# EAGLE design SPDT_eval (EAGLE 8.5.1)
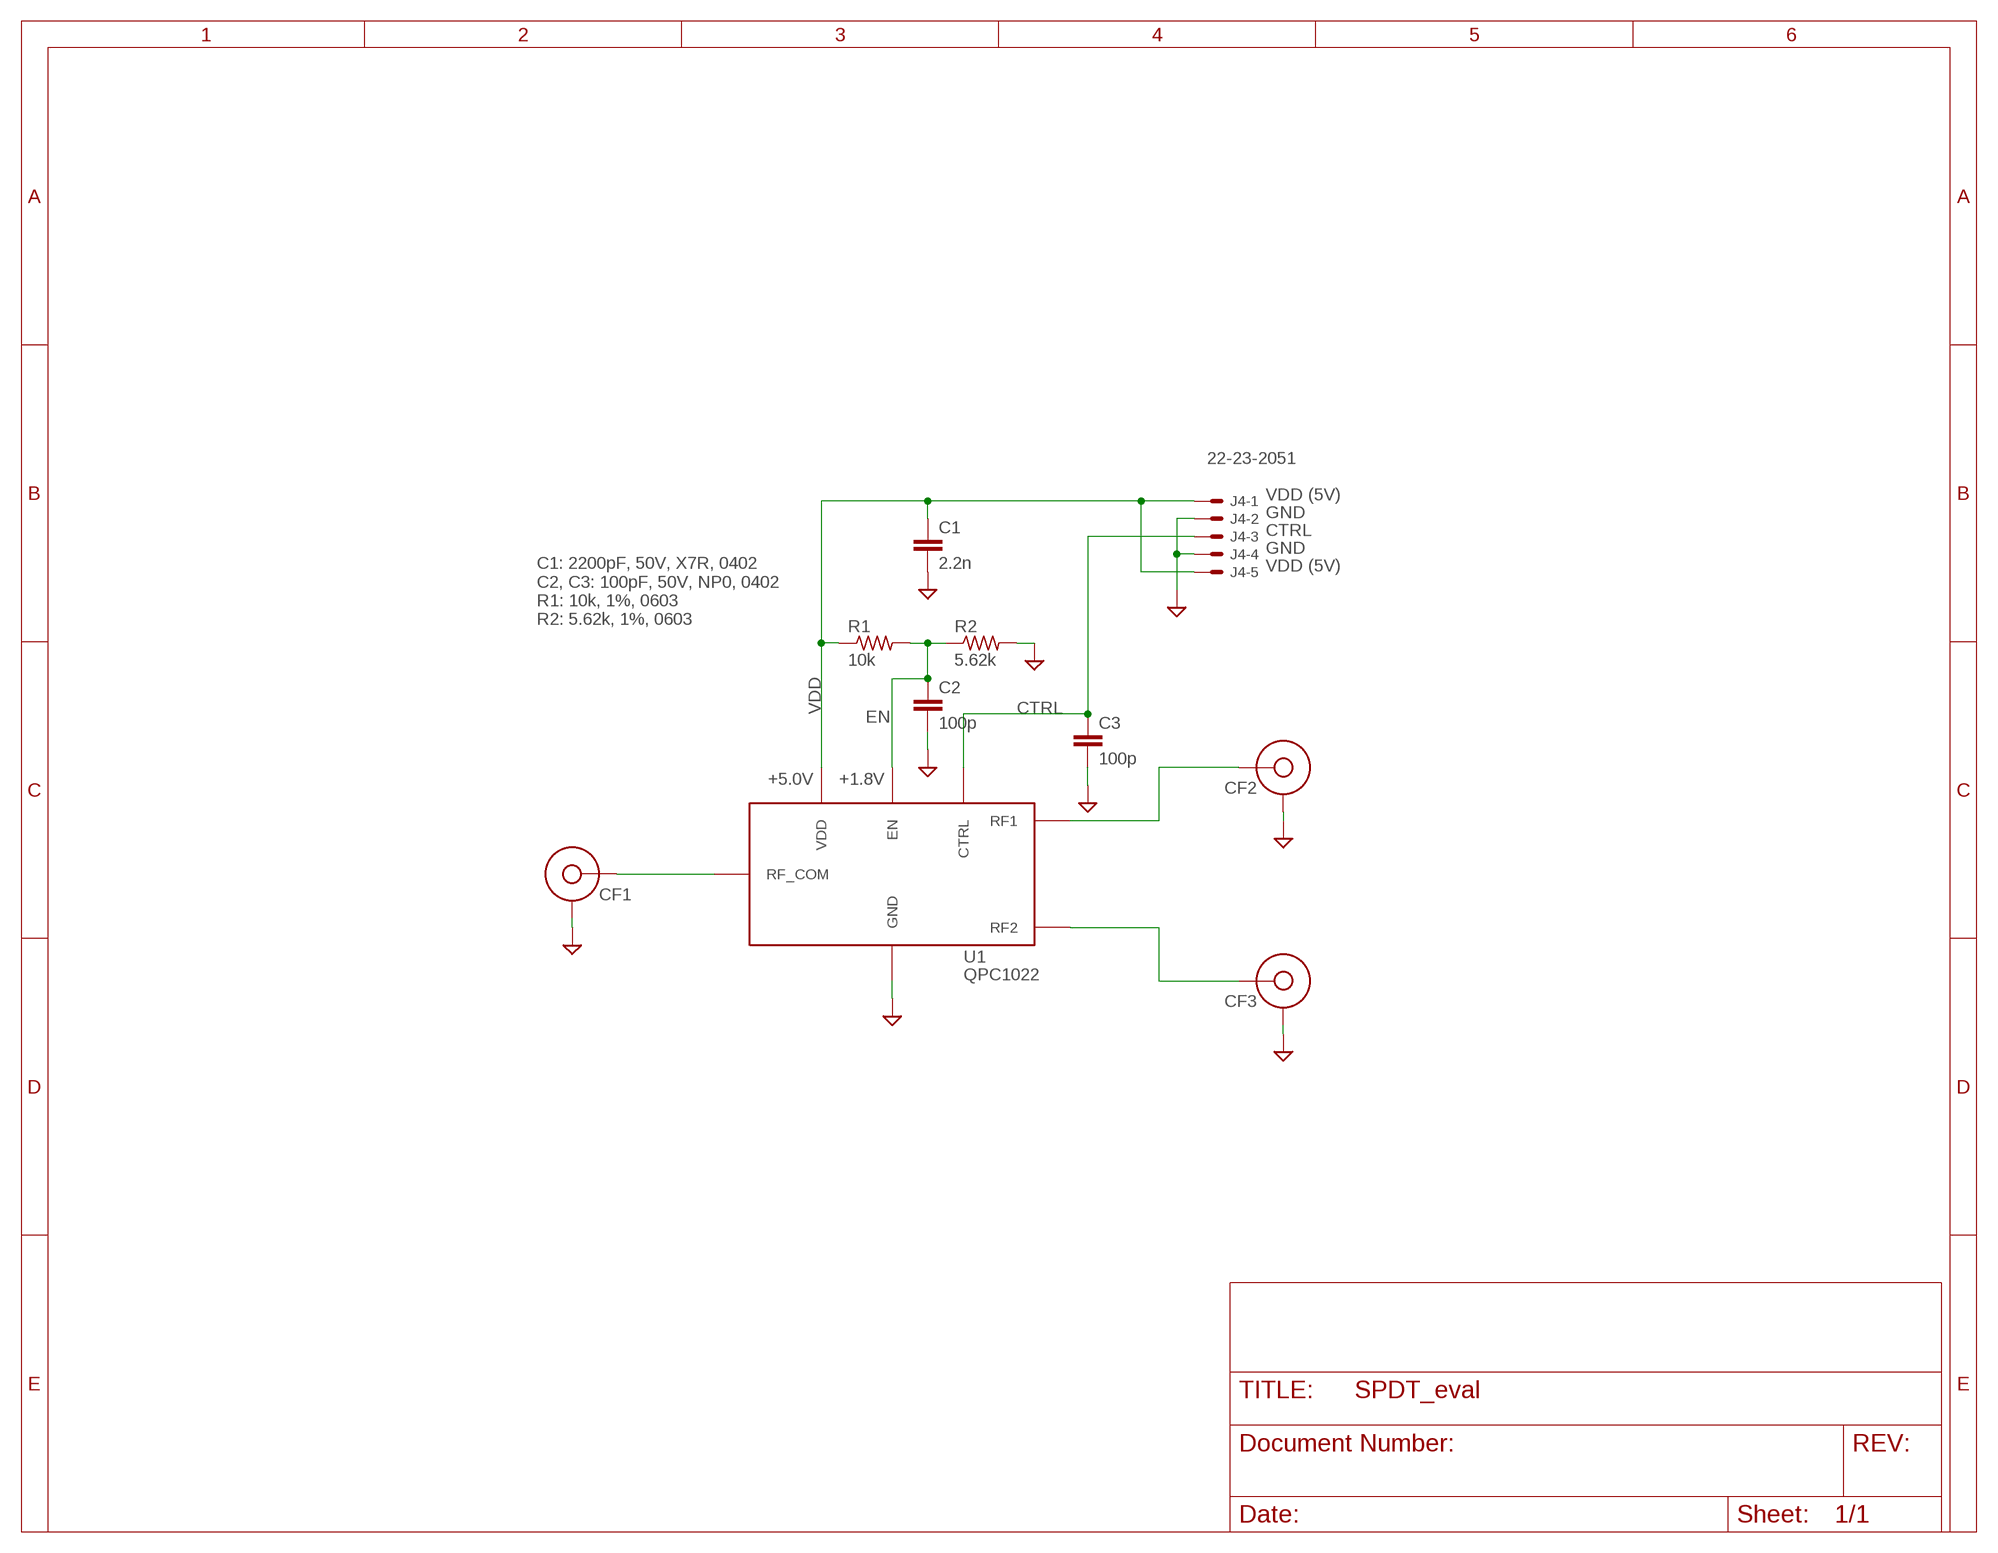
[diagram p0: schematic, sheet 1]

## Parts
C1  2.2n  C-EU0402-B-NOSILK  [.0402-B-NOSILK]
C2  100p  C-EU0402-B-NOSILK  [.0402-B-NOSILK]
C3  100p  C-EU0402-B-NOSILK  [.0402-B-NOSILK]
CF1  SMA-CINCH-END-FIRE  [SMAJ716-ND]
CF2  SMA-CINCH-END-FIRE  [SMAJ716-ND]
CF3  SMA-CINCH-END-FIRE  [SMAJ716-ND]
J4  22-23-2051  [22-23-2051]
R1  10k  R-US_0603-B-NOSILK  [.0603-B-NOSILK]
R2  5.62k  R-US_0603-B-NOSILK  [.0603-B-NOSILK]
U1  QPC1022  [QPC1022]

## Nets
COM [RF]: CF1.P$3(CENTERCONDUCTOR) U1.ANT(RF_COM)
CTRL: C3.1 J4.3 U1.CTRL
EN: C2.1 R1.2 R2.1 U1.EN
GND: C1.2 C2.2 C3.2 CF1.GND1(GND) CF1.GND2(GND) CF1.GND3(GND) CF1.GND4(GND) CF2.GND1(GND) CF2.GND2(GND) CF2.GND3(GND) CF2.GND4(GND) CF3.GND1(GND) CF3.GND2(GND) CF3.GND3(GND) CF3.GND4(GND) J4.2 J4.4 R2.2 U1.GND@1(GND) U1.GND@2(GND) U1.GND@3(GND)
RF1 [RF]: CF2.P$3(CENTERCONDUCTOR) U1.RF1
RF2 [RF]: CF3.P$3(CENTERCONDUCTOR) U1.RF2
VDD: C1.1 J4.1 J4.5 R1.1 U1.VDD

## Notes on the sheet
- VDD (5V)
- GND
- CTRL
- GND
- VDD (5V)
- C1: 2200pF, 50V, X7R, 0402
  C2, C3: 100pF, 50V, NP0, 0402
  R1: 10k, 1%, 0603
  R2: 5.62k, 1%, 0603
- +5.0V | +1.8V

## Library data of the parts
C1-C3 = rcl_custom:C-EU: CAPACITOR, European symbol
CF1-CF3 = psas_c3_team05:SMA-CINCH-END-FIRE
J4 = con-molex:22-23-2051: .100" (2.54mm) Center Header - 5 Pin; MF: MOLEX; MPN: 22-23-2051; OC_FARNELL: 1462952; OC_NEWARK: 38C9178
R1 R2 = rcl_custom:R-US_: RESISTOR, American symbol
U1 = QPC1022:QPC1022

## Net classes
1 RF: clearance 1.016 mm

## Board
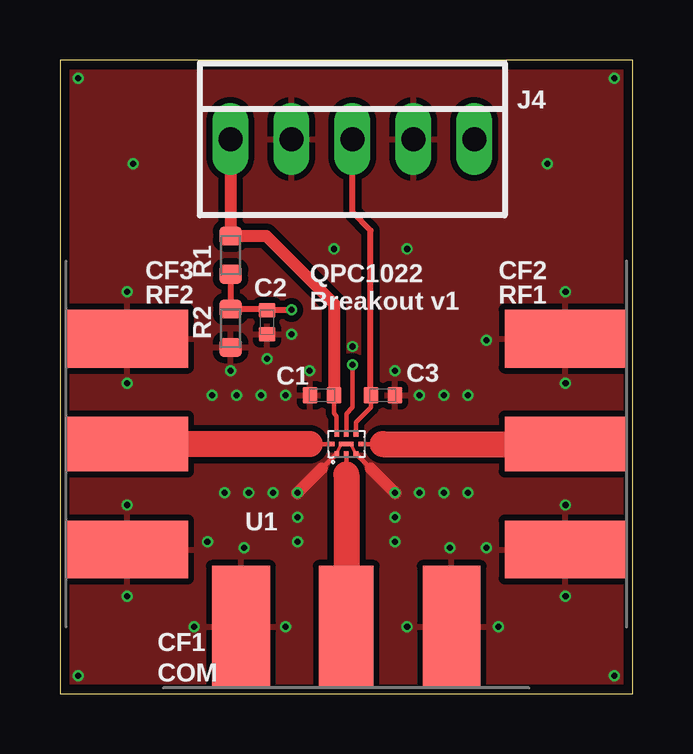
[diagram p1: board, top side]
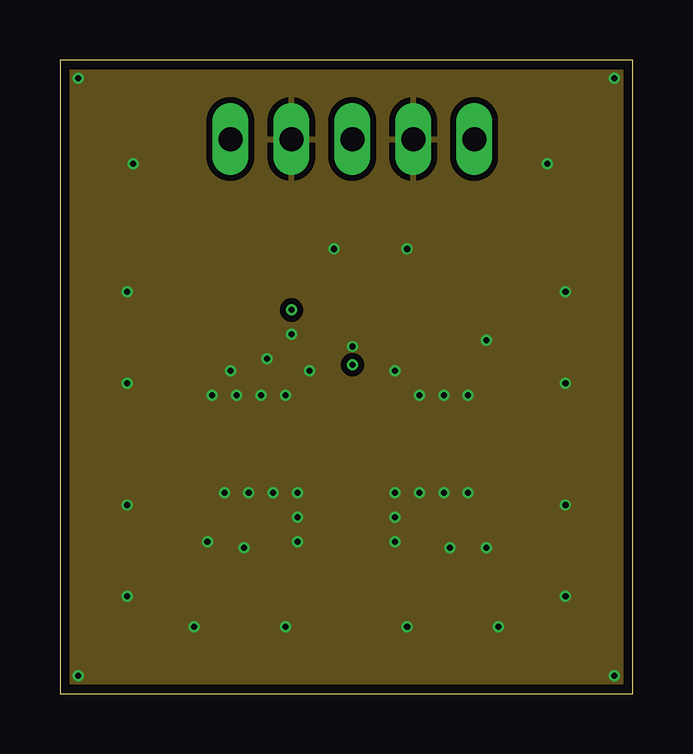
[diagram p2: board, inner layer Route2]
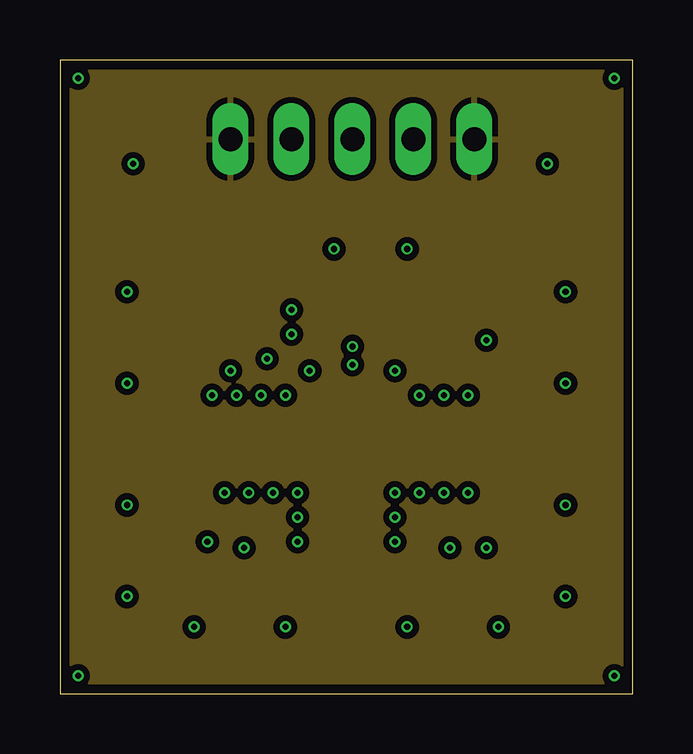
[diagram p3: board, inner layer Route15]
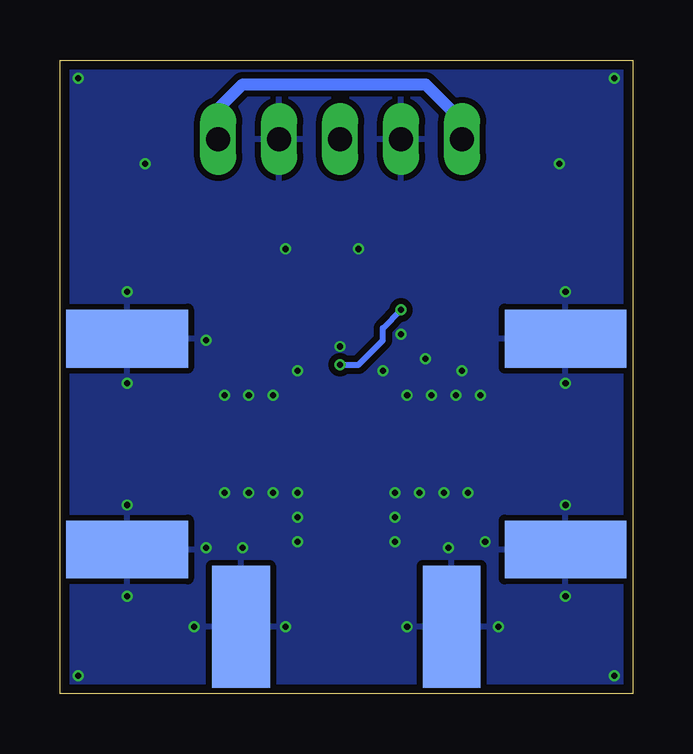
[diagram p4: board, bottom side, seen from below]

Size 23.88 x 26.42 mm. Coordinates in mm from the lower left corner, seen from the top.
Outline: 0,0 23.88,0 23.88,26.42 0,26.42 0,0
Copper layers (1*2*15*16): Top 0.035559375mm / dielectric 0.17018125mm / Route2 0.01778125mm / dielectric 47mil / Route15 0.01778125mm / dielectric 0.17018125mm / Bottom 0.035559375mm
Design rules "oshpark-4layer": minimum track width 5mil, minimum drill 10mil, track to track 5mil, track to pad 5mil, pad to pad 5mil, via to via 5mil, smd to smd 5mil, copper to edge 15mil, drill to drill 6mil, minimum pad ring 4mil, minimum via ring 4mil, stop-mask expansion 2.5mil, vias tented up to drill 0mil, thermal gap 10mil

### Footprints (pad centres in the part's own frame; a part is rotated, then mirrored left to right if it is on the bottom)
.0402-B-NOSILK = smd 0.6 x 0.7: 1 -0.5,0; 2 0.5,0
SMAJ716-ND = smd 2.413 x 5.08 bottom: GND1 4.394,0; GND3 -4.394,0 | smd 2.413 x 5.08: GND2 -4.394,0; GND4 4.394,0 | smd 2.286 x 5.08: P$3 0,0
22-23-2051 = drill 1 long: 1 -5.08,0; 2 -2.54,0; 3 0,0; 4 2.54,0; 5 5.08,0
.0603-B-NOSILK = smd 0.8 x 0.95: 1 -0.8,0; 2 0.8,0
QPC1022 = smd 0.2 x 0.2: ANT -0.4,0; CTRL 0.4,-0.4; EN 0.4,0; GND@1 -0.4,0.4; GND@2 -0.4,-0.4; RF1 0,-0.6; RF2 0,0.6; VDD 0.4,0.4 | smd 0.2 x 0.6: GND@3 0,0

### Placement (x,y rotation side)
C1  10.92,12.45 180 top
C2  8.64,15.49 270 top
C3  13.46,12.45 0 top
CF1  11.94,2.79 180 top
CF2  21.08,10.41 270 top
CF3  2.79,10.41 90 top
J4  12.19,23.11 0 top
R1  7.11,18.29 270 top
R2  7.11,15.24 270 top
U1  11.94,10.41 90 top

### Tracks (layer width: path | path; a pad name or v marks a point on that pad's centre or on a via)
COM
  Top 0.178: U1.ANT 11.94,9.14
  Top 1.092: 11.94,9.14 CF1.P$3
CTRL
  Top 0.178: U1.CTRL 12.34,11.32 12.96,11.95 C3.1
  Top 0.254: C3.1 12.95,19.3 12.19,20.07 J4.3
EN  (via drill 0.25)
  Top 0.178: U1.EN 11.94,11.68 12.19,11.94 v12.19,13.72
  Top 0.254: R1.2 R2.1 8.43,16.04 C2.1 8.48,16 v9.65,16
  Bottom 0.254: v12.19,13.72 11.43,13.72 10.41,14.73 10.41,15.24 v9.65,16
GND  (via drill 0.25)
  Top 0.127: U1.GND@1 11.73,10.41 | U1.GND@2 12.14,10.41
  Top 0.152: 11.73,10.41 U1.GND@3 12.14,10.41
  Top 0.178: U1.GND@1 10.92,9.4 | U1.GND@2 12.95,9.4
  Top 0.508: 10.92,9.4 v9.91,8.38 | 12.95,9.4 v13.97,8.38
  other vias: 2.79,16.76 16.26,6.1 7.67,6.1 9.4,12.45 14.99,12.45 8.64,13.97 7.11,13.46 0.76,25.65 23.11,25.65 23.11,0.76 0.76,0.76 2.79,4.06 2.79,12.95 2.79,7.87 5.59,2.79 9.4,2.79 14.48,2.79 18.29,2.79 21.08,4.06 21.08,7.87 21.08,12.95 21.08,16.76 6.15,6.35 17.78,14.73 17.78,6.1 8.38,12.45 7.37,12.45 6.35,12.45 16,12.45 17.02,12.45 17.02,8.38 16,8.38 14.99,8.38 8.89,8.38 7.87,8.38 6.86,8.38 9.91,7.37 9.91,6.35 13.97,7.37 13.97,6.35 13.97,13.46 12.19,14.48 10.41,13.46 9.65,14.99 11.43,18.54 3.05,22.1 20.32,22.1 14.48,18.54
  pour Top (isolate 0.254): 0,26.42 23.88,26.42 23.88,0 0,0
  pour Bottom (isolate 0.254): 0,26.42 23.88,26.42 23.88,0 0,0
  pour Route2 (isolate 0.254): 0,26.42 23.88,26.42 23.88,0 0,0
RF1
  Top 0.178: U1.RF1 13.46,10.41
  Top 1.092: 13.46,10.41 CF2.P$3
RF2
  Top 0.178: U1.RF2 10.41,10.41
  Top 1.092: 10.41,10.41 CF3.P$3
VDD
  Top 0.178: U1.VDD 11.54,11.58 11.42,11.69 C1.1
  Top 0.508: J4.1 R1.1 8.6,19.09 11.43,16.26 C1.1
  Bottom 0.508: J4.5 17.27,24.38 16.26,25.4 8.64,25.4 7.11,23.88 J4.1
  pour Route15 (isolate 0.254): 0,26.42 23.88,26.42 23.88,0 0,0

### Text on the board
tPlace: RF2 | QPC1022 / Breakout v1 | RF1 | COM